# EAGLE design microradio-standard (EAGLE 8.0.0)
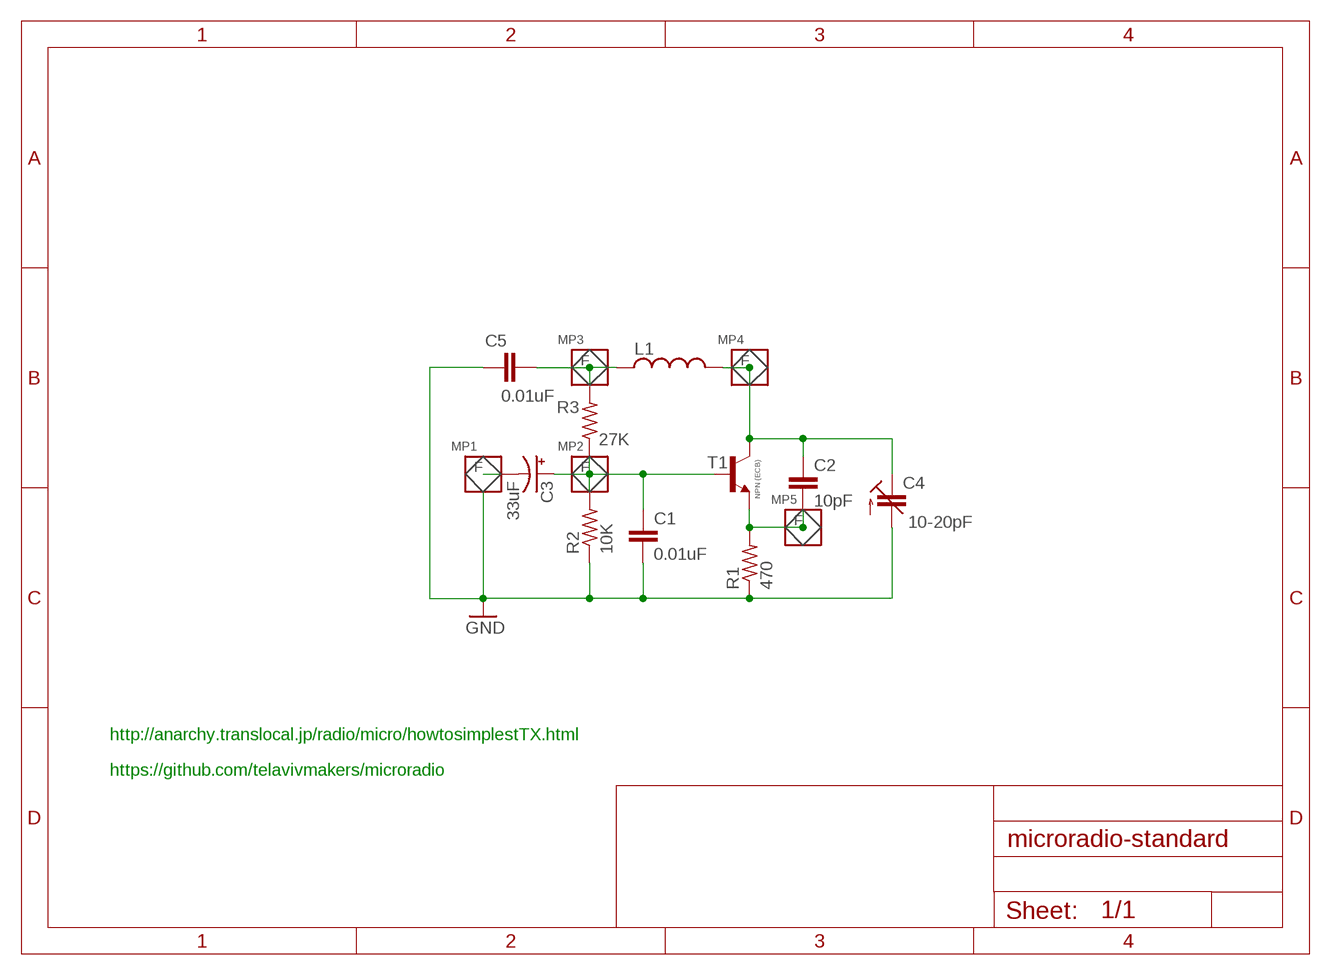
[diagram p0: schematic, sheet 1]

## Parts
C1  0.01uF  C  [M1206]
C2  10pF  C5/3  [C5B3]
C3  33uF  CPOL-US153CLV-0405  [153CLV-0405]
C4  10-20pF  C-TRIMM3008  [3008]
C5  0.01uF  C  [M1206]
L1  L-US0204/5  [0204/5]
MP1  MICROSTRIPMI  [MICROSTRIP_5X5MM]
MP2  MICROSTRIPMI  [MICROSTRIP_5X5MM]
MP3  MICROSTRIPMI  [MICROSTRIP_5X5MM]
MP4  MICROSTRIPMI  [MICROSTRIP_5X5MM]
MP5  MICROSTRIPMI  [MICROSTRIP_5X5MM]
R1  470  R-US_R1206  [R1206]
R2  10K  R-US_R1206  [R1206]
R3  27K  R-US_R1206  [R1206]
T1  NPN (ECB)  -NPN-TO92-BCE  [TO92-BCE]

## Nets
GND: C1.2 C4.-(A) C5.2 R1.1 R2.1
N$1: C3.- MP1.F(E)
N$2: C2.2 MP5.F(E) R1.2 T1.E
N$3: C5.1 L1.1 MP3.F(E) R3.2
N$4: C1.1 C3.+ MP2.F(E) R2.2 R3.1 T1.B
N$6: C2.1 C4.+(E) L1.2 MP4.F(E) T1.C

## Notes on the sheet
- http://anarchy.translocal.jp/radio/micro/howtosimplestTX.html
- https://github.com/telavivmakers/microradio

## Library data of the parts
C1 C2 C5 = microradio-standard:C: CAPACITOR naming: grid - package width
C3 = microradio-standard:CPOL-US: POLARIZED CAPACITOR, American symbol
C4 = microradio-standard:C-TRIMM: Trimm capacitor; OC_FARNELL: unknown; OC_NEWARK: unknown
L1 = microradio-standard:L-US: INDUCTOR, American symbol
MP1-MP5 = microradio-standard:MICROSTRIP
R1-R3 = microradio-standard:R-US_: RESISTOR, American symbol
T1 = microradio-standard:*-NPN-: NPN Transistror BF959 corrected 2008.03.06

## Board
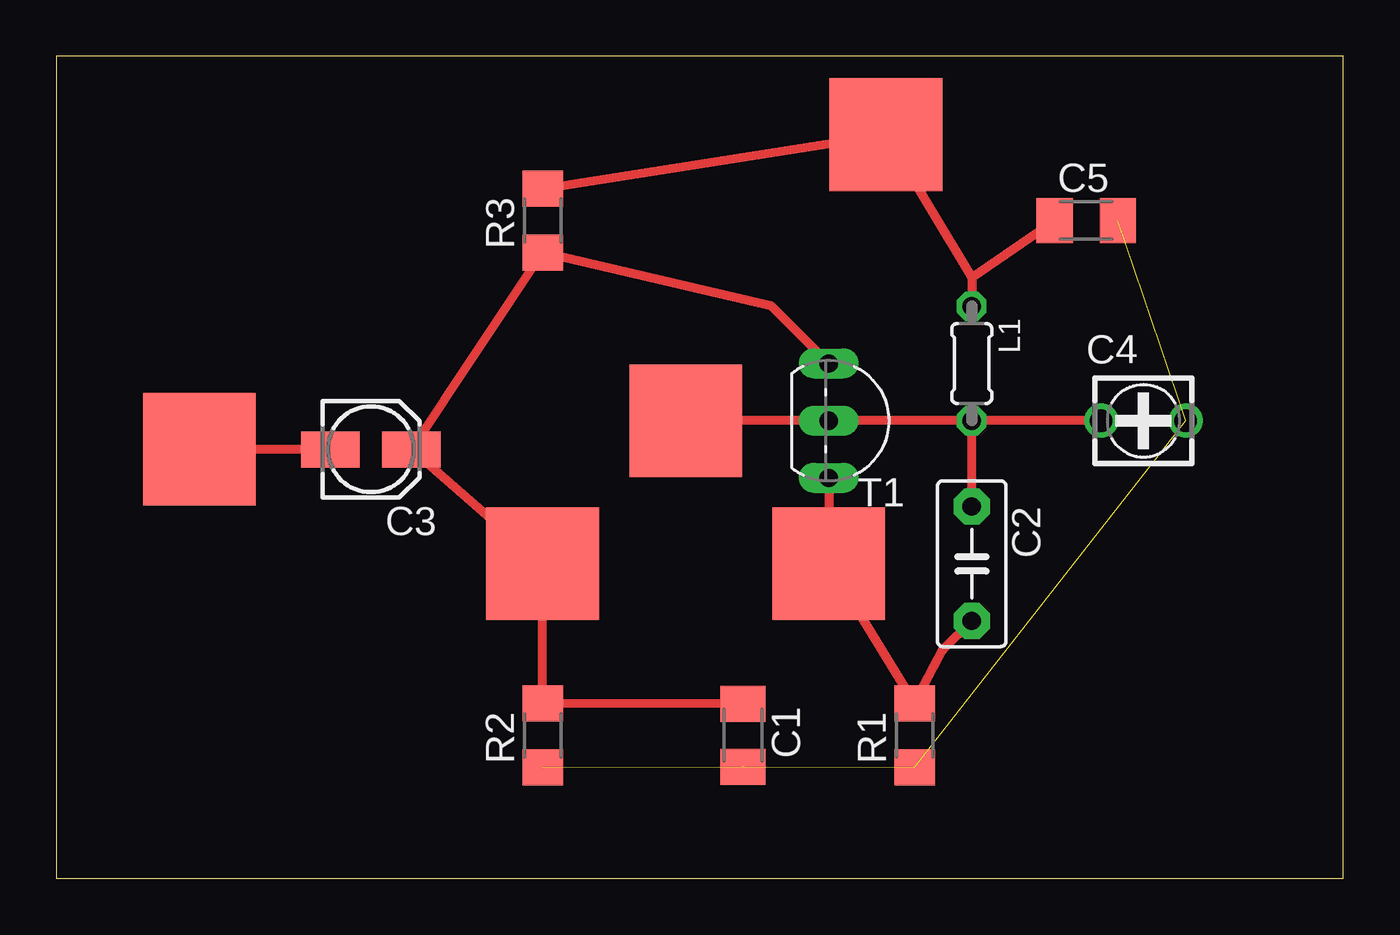
[diagram p1: board, top side]
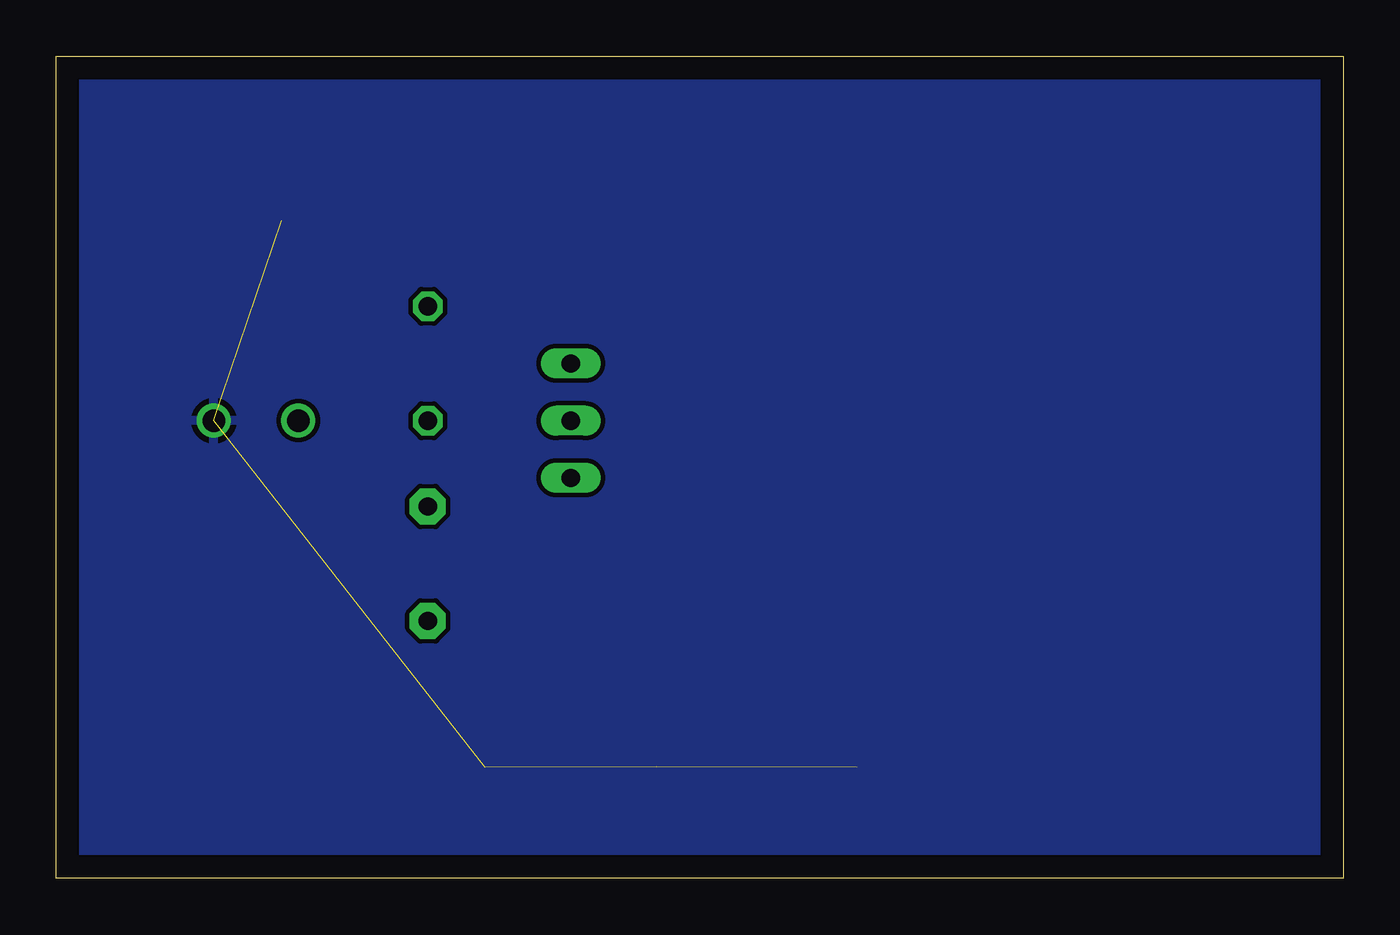
[diagram p2: board, bottom side, seen from below]

Size 57.13 x 36.5 mm. Coordinates in mm from the lower left corner, seen from the top.
Outline: 0,0 57.13,0 57.13,36.5 0,36.5 0,0
Copper layers (1*16): Top 0.035mm / dielectric 1.5mm / Bottom 0.035mm
Design rules "default": minimum track width 10mil, minimum drill 24mil, track to track 8mil, track to pad 8mil, pad to pad 8mil, via to via 8mil, smd to smd 8mil, copper to edge 40mil, drill to drill 8mil, minimum pad ring 10mil, minimum via ring 8mil, stop-mask expansion 4mil, vias tented up to drill 0mil, thermal gap 10mil

### Footprints (pad centres in the part's own frame; a part is rotated, then mirrored left to right if it is on the bottom)
M1206 = smd 1.6 x 2: 1 -1.4,0; 2 1.4,0
C5B3 = drill 0.813 pad 1.6 octagon: 1 -2.54,0; 2 2.54,0
153CLV-0405 = smd 2.6 x 1.6: + 1.8,0; - -1.8,0
3008 = drill 1: + -1.875,0; - 1.875,0
0204/5 = drill 0.813 octagon: 1 -2.54,0; 2 2.54,0
MICROSTRIP_5X5MM = smd 5 x 5: F 0,0
R1206 = smd 1.6 x 1.803: 1 -1.422,0; 2 1.422,0
TO92-BCE = drill 0.813 long: B -2.54,0; C 0,0; E 2.54,0

### Placement (x,y rotation side)
C1  30.48,6.35 270 top
C2  40.64,13.97 270 top
C3  13.97,19.05 0 top
C4  48.26,20.32 0 top
C5  45.72,29.21 0 top
L1  40.64,22.86 270 top
MP1  6.35,19.05 0 top
MP2  21.59,13.97 0 top
MP3  36.83,33.02 0 top
MP4  27.94,20.32 0 top
MP5  34.29,13.97 0 top
R1  38.1,6.35 90 top
R2  21.59,6.35 90 top
R3  21.59,29.21 90 top
T1  34.29,20.32 270 top

### Tracks (layer width: path | path; a pad name or v marks a point on that pad's centre or on a via)
GND  (4 unrouted)
  pour Bottom: 0,36.83 57.15,36.83 57.15,0 0,0
N$1
  Top 0.406: C3.- MP1.F
N$2
  Top 0.406: C2.2 39.37,10.16 R1.2 MP5.F T1.E
N$3
  Top 0.406: 40.64,26.67 L1.1 | 40.64,26.67 C5.1 | R3.2 MP3.F 40.64,26.67
N$4
  Top 0.406: T1.B 31.75,25.4 R3.1 C3.+ MP2.F R2.2 C1.1
N$6
  Top 0.406: C2.1 L1.2 | C4.+ L1.2 | L1.2 T1.C MP4.F